# Altium schematic sheet Sheet1.SchDoc
size A4
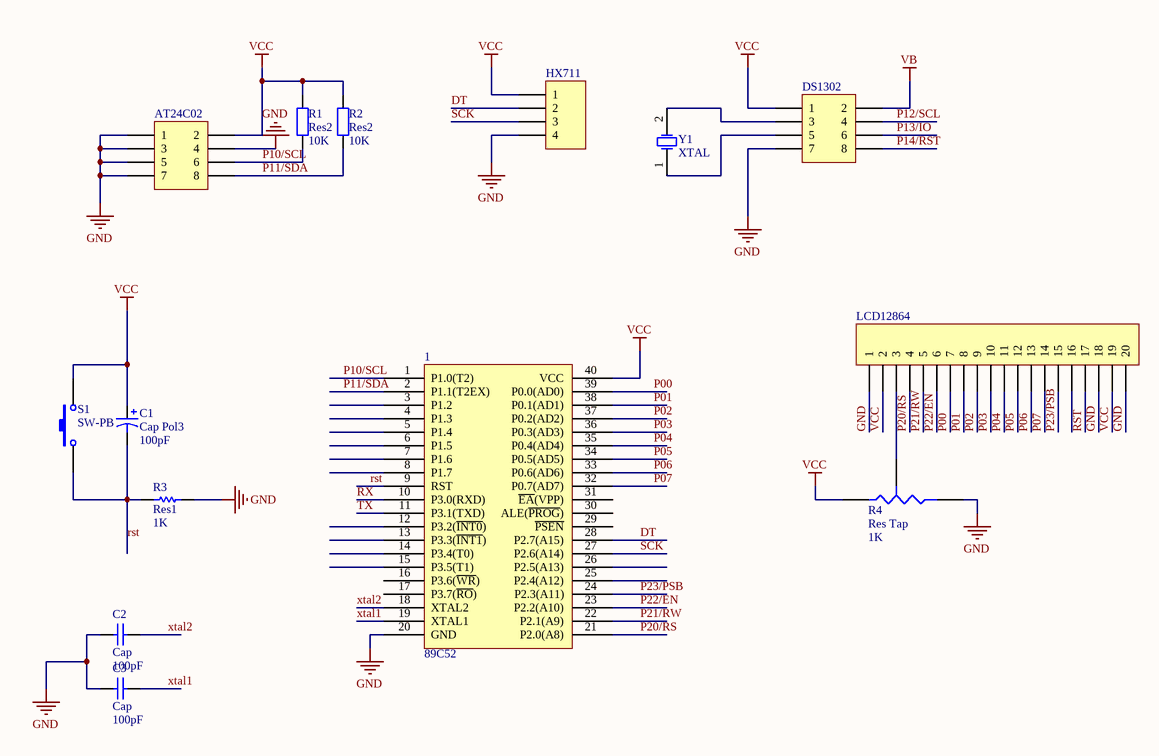
[diagram p0: Sheet1.SchDoc]

## Parts
1  89C52
AT24C02  (no value)  [HDR2X4]
C1  Cap Pol3  value 100pF  [C0805]
C2  Cap  value 100pF  [RAD-0.3]
C3  Cap  value 100pF  [RAD-0.3]
DS1302  (no value)  [HDR2X4]
HX711  (no value)  [HDR1X4]
LCD12864  (no value)  [HDR1X20]
R1  Res2  value 10K  [AXIAL-0.4]
R2  Res2  value 10K  [AXIAL-0.4]
R3  Res1  value 1K  [AXIAL-0.3]
R4  Res Tap  value 1K  [VR3]
S1  SW-PB  [SPST-2]
Y1  XTAL  [R38]

## Nets
GND: 1.20(GND) AT24C02.1 AT24C02.3 AT24C02.4 AT24C02.5 AT24C02.7 C2.1 C3.1 DS1302.7 HX711.4 LCD12864.1 LCD12864.18 LCD12864.20 R3.1 R4.2(B)
VB: DS1302.2
VCC: 1.40(VCC) AT24C02.2 C1.1 DS1302.1 HX711.1 LCD12864.2 LCD12864.19 R1.2 R2.2 R4.1(A) S1.2
DT: 1.28(P2.7(A15)) HX711.2
P00: 1.39(P0.0(AD0)) LCD12864.7
P01: 1.38(P0.1(AD1)) LCD12864.8
P02: 1.37(P0.2(AD2)) LCD12864.9
P03: 1.36(P0.3(AD3)) LCD12864.10
P04: 1.35(P0.4(AD4)) LCD12864.11
P05: 1.34(P0.5(AD5)) LCD12864.12
P06: 1.33(P0.6(AD6)) LCD12864.13
P07: 1.32(P0.7(AD7)) LCD12864.14
P10/SCL: 1.1(P1.0(T2)) AT24C02.6 R1.1
P11/SDA: 1.2(P1.1(T2EX)) AT24C02.8 R2.1
P12/SCL: DS1302.4
P13/IO: DS1302.6
P14/RST: DS1302.8
P20/RS: 1.21(P2.0(A8)) LCD12864.4
P21/RW: 1.22(P2.1(A9)) LCD12864.5
P22/EN: 1.23(P2.2(A10)) LCD12864.6
P23/PSB: 1.24(P2.3(A11)) LCD12864.15
rst: 1.9(RST) C1.2 LCD12864.17 R3.2 S1.1
RX: 1.10(P3.0(RXD))
SCK: 1.27(P2.6(A14)) HX711.3
TX: 1.11(P3.1(TXD))
xtal1: 1.19(XTAL1) C3.2
xtal2: 1.18(XTAL2) C2.2
NetDS1302_3: DS1302.3 Y1.2(OSC2)
NetDS1302_5: DS1302.5 Y1.1(OSC1)
NetLCD12864_3: LCD12864.3 R4.3(TAP)

Not connected (* = marked no-connect by the designer): 1 3(P1.2) 4(P1.3) 5(P1.4) 6(P1.5) 7(P1.6) 8(P1.7) 12(P3.2(~{INT0})) 13(P3.3(~{INT1})) 14(P3.4(T0)) 15(P3.5(T1)) 16(P3.6(~{WR})) 17(P3.7(~{RO})) 25(P2.4(A12)) 26(P2.5(A13)) 29(~{PSEN}) 30(ALE(~{PROG})) 31(~{EA}(VPP)); LCD12864 16

## Library data of the parts
AT24C02 DS1302 = Header 4X2: Header, 4-Pin, Dual row; LatestRevisionDate: 17-Jul-2002; LatestRevisionNote: Re-released for DXP Platform.; Publisher: Altium Limited
C1 = Cap Pol3: Polarized Capacitor (Surface Mount); Published: 8-Jun-2000; LatestRevisionDate: 29-May-2009; LatestRevisionNote: IPC-7351 Footprint Added.; PackageReference: C0805; Publisher: Altium Limited; PackageDescription: Chip Capacitor
C2 C3 = Cap: Capacitor; Published: 8-Jun-2000; LatestRevisionDate: 17-Jul-2002; LatestRevisionNote: Re-released for DXP Platform.; PackageReference: RAD-0.3; Publisher: Altium Limited; PackageDescription: Radial Cap, Thru-Hole; 2 Leads; 0.3 in Pin Spacing
HX711 = Header 4: Header, 4-Pin; LatestRevisionDate: 17-Jul-2002; LatestRevisionNote: Re-released for DXP Platform.; Publisher: Altium Limited
LCD12864 = Header 20: Header, 20-Pin; LatestRevisionDate: 17-Jul-2002; LatestRevisionNote: Re-released for DXP Platform.; Publisher: Altium Limited
R1 R2 = Res2: Resistor; Published: 8-Jun-2000; LatestRevisionDate: 17-Jul-2002; LatestRevisionNote: Re-released for DXP Platform.; PackageReference: AXIAL-0.4; Publisher: Altium Limited; PackageDescription: Axial Device, Thru-Hole; 2 Leads; 0.4 in Pin Spacing
R3 = Res1: Resistor; Published: 8-Jun-2000; LatestRevisionDate: 17-Jul-2002; LatestRevisionNote: Re-released for DXP Platform.; PackageReference: AXIAL-0.3; Publisher: Altium Limited; PackageDescription: Axial Device, Thru-Hole; 2 Leads; 0.3 in Pin Spacing
R4 = Res Tap: Tapped Resistor; Sim Note: Enter the Resistance value and the set point into parameter fields.; Set Position: 0.5; Published: 24-Mar-1999; LatestRevisionDate: 17-Jul-2002; LatestRevisionNote: Re-released for DXP Platform.; PackageReference: VR3; Publisher: Altium Limited; PackageDescription: Variable Resistor, Thru-Hole; 3 Leads
S1 = SW-PB: Switch; Published: 24-Mar-1999; LatestRevisionDate: 17-Jul-2002; LatestRevisionNote: Re-released for DXP Platform.; PackageReference: SPST-2; Publisher: Altium Limited; PackageDescription: Switch; 2 Leads
Y1 = XTAL: Crystal Oscillator; Published: 8-Jun-2000; LatestRevisionDate: 17-Jul-2002; LatestRevisionNote: Re-released for DXP Platform.; PackageReference: R38; Publisher: Altium Limited; PackageDescription: Crystal, Thru-Hole; 2 Leads; Body 3.1 x 8.2 mm (Dia.xH)